# Altium schematic sheet 0038_PCH_USB.SchDoc
size A3
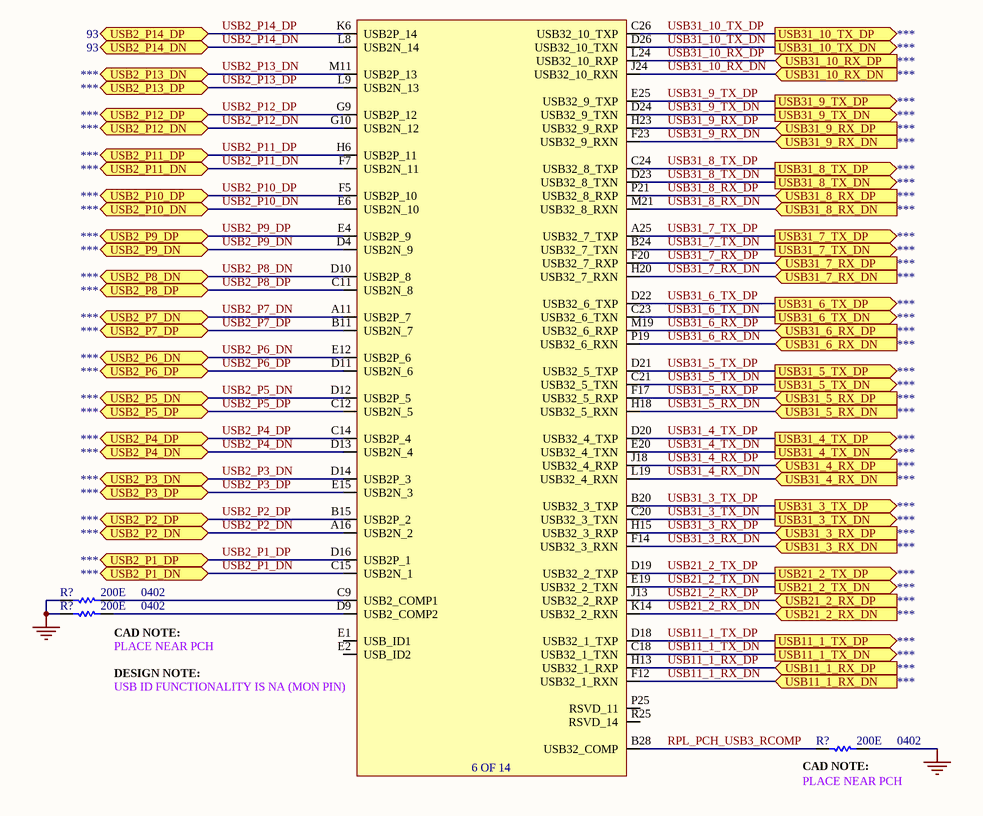
[diagram p0: 0038_PCH_USB.SchDoc]

## Parts
(Parts that share a designator on the sheet are numbered #1, #2 ... from top to bottom, then left to right.)
R?#1  value 200E  Case/Package: 0402  [RESC0402]  (hidden comment: Res)
R?#2  value 200E  Case/Package: 0402  [RESC0402]  (hidden comment: Res)
R?#3  value 200E  Case/Package: 0402  [RESC0402]  (hidden comment: Res)
U23601  C_RPL_S_PCH_EXT  (value not drawn)  (part F of 14)

## Ports
USB2_P1_DN (bidir), USB2_P1_DP (bidir), USB2_P2_DN (bidir), USB2_P2_DP (bidir), USB2_P3_DN (bidir), USB2_P3_DP (bidir), USB2_P4_DN (bidir), USB2_P4_DP (bidir), USB2_P5_DN (bidir), USB2_P5_DP (bidir), USB2_P6_DN (bidir), USB2_P6_DP (bidir), USB2_P7_DN (bidir), USB2_P7_DP (bidir), USB2_P8_DN (bidir), USB2_P8_DP (bidir), USB2_P9_DN (bidir), USB2_P9_DP (bidir), USB2_P10_DN (bidir), USB2_P10_DP (bidir), USB2_P11_DN (bidir), USB2_P11_DP (bidir), USB2_P12_DN (bidir), USB2_P12_DP (bidir), USB2_P13_DN (bidir), USB2_P13_DP (bidir), USB2_P14_DN (bidir), USB2_P14_DP (bidir), USB11_1_RX_DN (in), USB11_1_RX_DP (in), USB11_1_TX_DN (out), USB11_1_TX_DP (out), USB21_2_RX_DN (in), USB21_2_RX_DP (in), USB21_2_TX_DN (out), USB21_2_TX_DP (out), USB31_3_RX_DN (in), USB31_3_RX_DP (in), USB31_3_TX_DN (out), USB31_3_TX_DP (out), USB31_4_RX_DN (in), USB31_4_RX_DP (in), USB31_4_TX_DN (out), USB31_4_TX_DP (out), USB31_5_RX_DN (in), USB31_5_RX_DP (in), USB31_5_TX_DN (out), USB31_5_TX_DP (out), USB31_6_RX_DN (in), USB31_6_RX_DP (in), USB31_6_TX_DN (out), USB31_6_TX_DP (out), USB31_7_RX_DN (in), USB31_7_RX_DP (in), USB31_7_TX_DN (out), USB31_7_TX_DP (out), USB31_8_RX_DN (in), USB31_8_RX_DP (in), USB31_8_TX_DN (out), USB31_8_TX_DP (out), USB31_9_RX_DN (in), USB31_9_RX_DP (in), USB31_9_TX_DN (out), USB31_9_TX_DP (out), USB31_10_RX_DN (in), USB31_10_RX_DP (in), USB31_10_TX_DN (out), USB31_10_TX_DP (out)

## Nets
GND: R?#1.1 R?#2.1 R?#3.2
RPL_PCH_USB3_RCOMP: R?#3.1 U23601.B28(USB32_COMP)
USB2_P1_DN: U23601.C15(USB2N_1) ; port USB2_P1_DN
USB2_P1_DP: U23601.D16(USB2P_1) ; port USB2_P1_DP
USB2_P2_DN: U23601.A16(USB2N_2) ; port USB2_P2_DN
USB2_P2_DP: U23601.B15(USB2P_2) ; port USB2_P2_DP
USB2_P3_DN: U23601.D14(USB2P_3) ; port USB2_P3_DN
USB2_P3_DP: U23601.E15(USB2N_3) ; port USB2_P3_DP
USB2_P4_DN: U23601.D13(USB2N_4) ; port USB2_P4_DN
USB2_P4_DP: U23601.C14(USB2P_4) ; port USB2_P4_DP
USB2_P5_DN: U23601.D12(USB2P_5) ; port USB2_P5_DN
USB2_P5_DP: U23601.C12(USB2N_5) ; port USB2_P5_DP
USB2_P6_DN: U23601.E12(USB2P_6) ; port USB2_P6_DN
USB2_P6_DP: U23601.D11(USB2N_6) ; port USB2_P6_DP
USB2_P7_DN: U23601.A11(USB2P_7) ; port USB2_P7_DN
USB2_P7_DP: U23601.B11(USB2N_7) ; port USB2_P7_DP
USB2_P8_DN: U23601.D10(USB2P_8) ; port USB2_P8_DN
USB2_P8_DP: U23601.C11(USB2N_8) ; port USB2_P8_DP
USB2_P9_DN: U23601.D4(USB2N_9) ; port USB2_P9_DN
USB2_P9_DP: U23601.E4(USB2P_9) ; port USB2_P9_DP
USB2_P10_DN: U23601.E6(USB2N_10) ; port USB2_P10_DN
USB2_P10_DP: U23601.F5(USB2P_10) ; port USB2_P10_DP
USB2_P11_DN: U23601.F7(USB2N_11) ; port USB2_P11_DN
USB2_P11_DP: U23601.H6(USB2P_11) ; port USB2_P11_DP
USB2_P12_DN: U23601.G10(USB2N_12) ; port USB2_P12_DN
USB2_P12_DP: U23601.G9(USB2P_12) ; port USB2_P12_DP
USB2_P13_DN: U23601.M11(USB2P_13) ; port USB2_P13_DN
USB2_P13_DP: U23601.L9(USB2N_13) ; port USB2_P13_DP
USB2_P14_DN: U23601.L8(USB2N_14) ; port USB2_P14_DN
USB2_P14_DP: U23601.K6(USB2P_14) ; port USB2_P14_DP
USB11_1_RX_DN: U23601.F12(USB32_1_RXN) ; port USB11_1_RX_DN
USB11_1_RX_DP: U23601.H13(USB32_1_RXP) ; port USB11_1_RX_DP
USB11_1_TX_DN: U23601.C18(USB32_1_TXN) ; port USB11_1_TX_DN
USB11_1_TX_DP: U23601.D18(USB32_1_TXP) ; port USB11_1_TX_DP
USB21_2_RX_DN: U23601.K14(USB32_2_RXN) ; port USB21_2_RX_DN
USB21_2_RX_DP: U23601.J13(USB32_2_RXP) ; port USB21_2_RX_DP
USB21_2_TX_DN: U23601.E19(USB32_2_TXN) ; port USB21_2_TX_DN
USB21_2_TX_DP: U23601.D19(USB32_2_TXP) ; port USB21_2_TX_DP
USB31_3_RX_DN: U23601.F14(USB32_3_RXN) ; port USB31_3_RX_DN
USB31_3_RX_DP: U23601.H15(USB32_3_RXP) ; port USB31_3_RX_DP
USB31_3_TX_DN: U23601.C20(USB32_3_TXN) ; port USB31_3_TX_DN
USB31_3_TX_DP: U23601.B20(USB32_3_TXP) ; port USB31_3_TX_DP
USB31_4_RX_DN: U23601.L19(USB32_4_RXN) ; port USB31_4_RX_DN
USB31_4_RX_DP: U23601.J18(USB32_4_RXP) ; port USB31_4_RX_DP
USB31_4_TX_DN: U23601.E20(USB32_4_TXN) ; port USB31_4_TX_DN
USB31_4_TX_DP: U23601.D20(USB32_4_TXP) ; port USB31_4_TX_DP
USB31_5_RX_DN: U23601.H18(USB32_5_RXN) ; port USB31_5_RX_DN
USB31_5_RX_DP: U23601.F17(USB32_5_RXP) ; port USB31_5_RX_DP
USB31_5_TX_DN: U23601.C21(USB32_5_TXN) ; port USB31_5_TX_DN
USB31_5_TX_DP: U23601.D21(USB32_5_TXP) ; port USB31_5_TX_DP
USB31_6_RX_DN: U23601.P19(USB32_6_RXN) ; port USB31_6_RX_DN
USB31_6_RX_DP: U23601.M19(USB32_6_RXP) ; port USB31_6_RX_DP
USB31_6_TX_DN: U23601.C23(USB32_6_TXN) ; port USB31_6_TX_DN
USB31_6_TX_DP: U23601.D22(USB32_6_TXP) ; port USB31_6_TX_DP
USB31_7_RX_DN: U23601.H20(USB32_7_RXN) ; port USB31_7_RX_DN
USB31_7_RX_DP: U23601.F20(USB32_7_RXP) ; port USB31_7_RX_DP
USB31_7_TX_DN: U23601.B24(USB32_7_TXN) ; port USB31_7_TX_DN
USB31_7_TX_DP: U23601.A25(USB32_7_TXP) ; port USB31_7_TX_DP
USB31_8_RX_DN: U23601.M21(USB32_8_RXN) ; port USB31_8_RX_DN
USB31_8_RX_DP: U23601.P21(USB32_8_RXP) ; port USB31_8_RX_DP
USB31_8_TX_DN: U23601.D23(USB32_8_TXN) ; port USB31_8_TX_DN
USB31_8_TX_DP: U23601.C24(USB32_8_TXP) ; port USB31_8_TX_DP
USB31_9_RX_DN: U23601.F23(USB32_9_RXN) ; port USB31_9_RX_DN
USB31_9_RX_DP: U23601.H23(USB32_9_RXP) ; port USB31_9_RX_DP
USB31_9_TX_DN: U23601.D24(USB32_9_TXN) ; port USB31_9_TX_DN
USB31_9_TX_DP: U23601.E25(USB32_9_TXP) ; port USB31_9_TX_DP
USB31_10_RX_DN: U23601.J24(USB32_10_RXN) ; port USB31_10_RX_DN
USB31_10_RX_DP: U23601.L24(USB32_10_RXP) ; port USB31_10_RX_DP
USB31_10_TX_DN: U23601.D26(USB32_10_TXN) ; port USB31_10_TX_DN
USB31_10_TX_DP: U23601.C26(USB32_10_TXP) ; port USB31_10_TX_DP
NetR?#1_2: R?#1.2 U23601.C9(USB2_COMP1)
NetR?#2_2: R?#2.2 U23601.D9(USB2_COMP2)

Not connected (* = marked no-connect by the designer): U23601 E1(USB_ID1) E2(USB_ID2) P25(RSVD_11) R25(RSVD_14)

## Notes on the sheet
- (near R?#2) CAD NOTE:
- (near R?#2) PLACE NEAR PCH
- DESIGN NOTE:
- (near U23601) USB ID FUNCTIONALITY IS NA (MON PIN)
- (near R?#3) CAD NOTE:
- (near R?#3) PLACE NEAR PCH
- (in symbol C_RPL_S_PCH_EXT, part F) 6 OF 14

## Library data of the parts
R?#1-R?#3 = Res: Thick Film Resistor -  200ohm, 1%, 0402
U23601 = C_RPL_S_PCH_EXT: Manufacturer Part Number: *; Case/Package: *